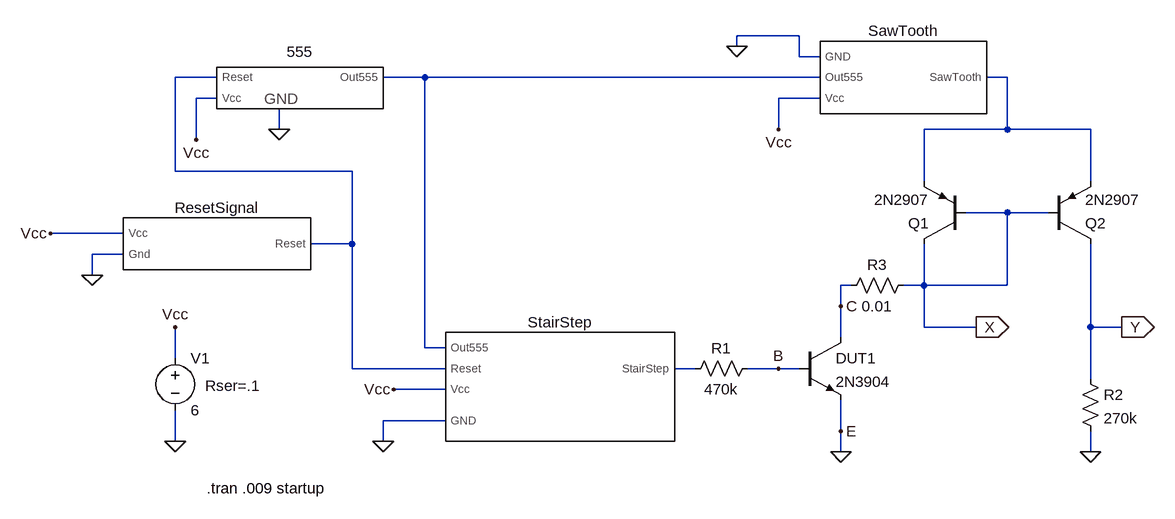
[diagram p0: schematic Mod5_DUT.asc]
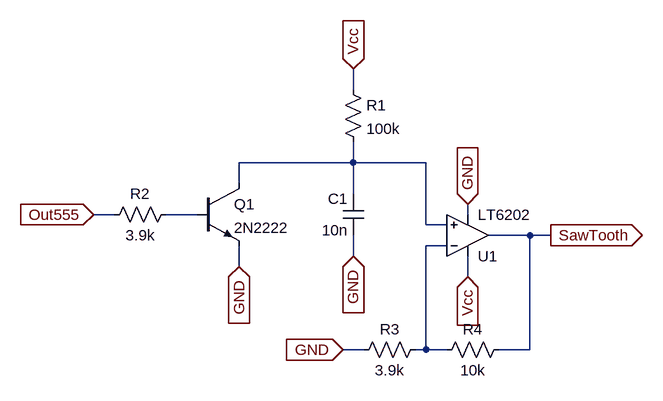
[diagram p1: sub-circuit mod4_sawtooth.asc]
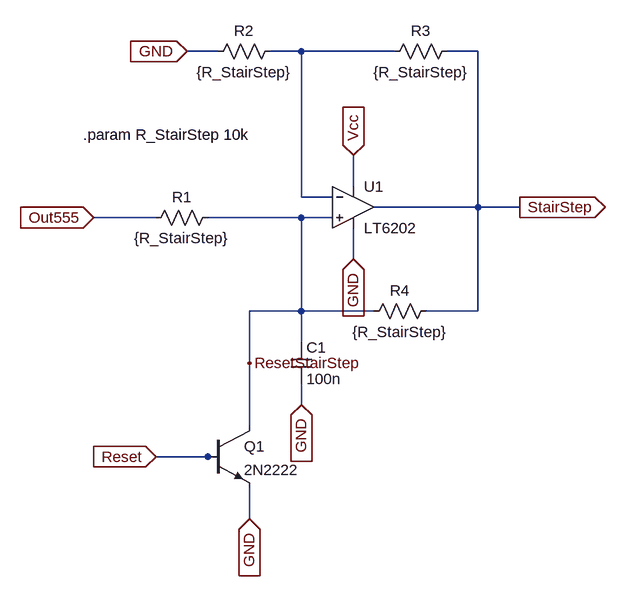
[diagram p2: sub-circuit mod3_stairstep.asc]
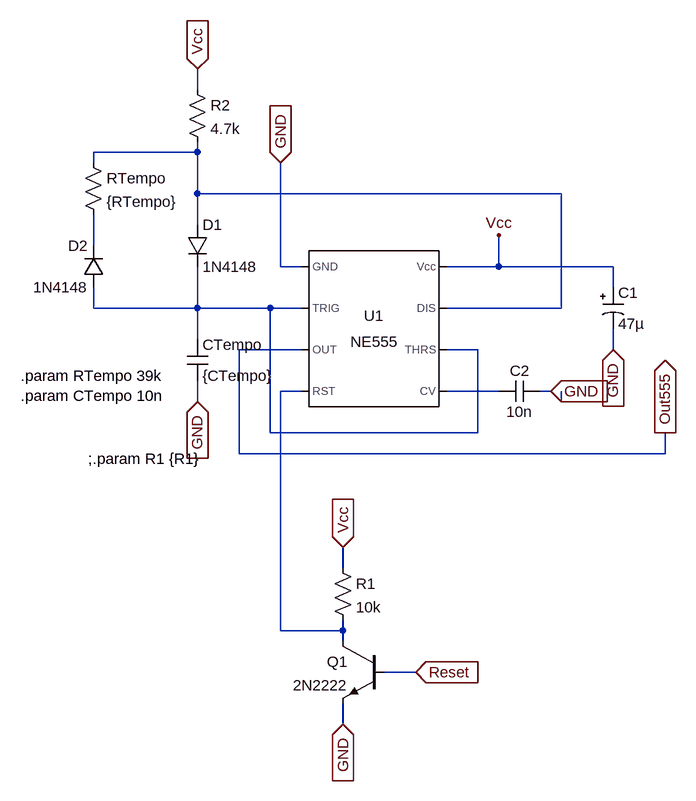
[diagram p3: sub-circuit mod1_555.asc]
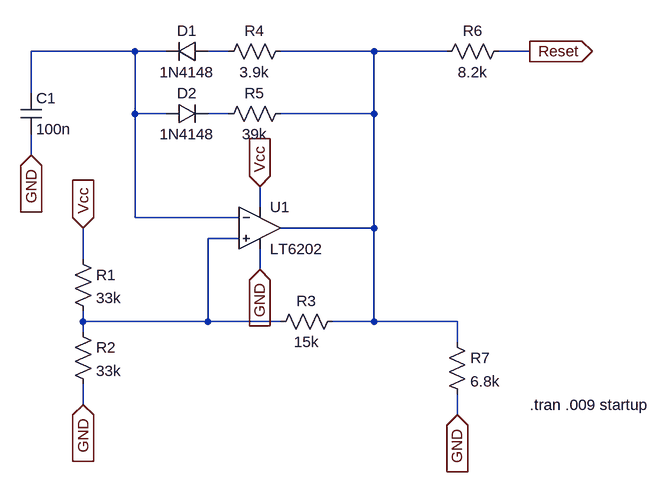
[diagram p4: sub-circuit mod2_resetsignal.asc]
Mod5_DUT.asc, the LTspice schematic file:
Version 4.1
SHEET 1 880 680
WIRE -240 -368 -336 -368
WIRE -336 -352 -336 -368
WIRE -240 -336 -240 -368
WIRE -208 -336 -240 -336
WIRE -1136 -304 -1200 -304
WIRE -816 -304 -880 -304
WIRE -208 -304 -816 -304
WIRE 80 -304 48 -304
WIRE -1136 -272 -1168 -272
WIRE -208 -272 -272 -272
WIRE -1040 -224 -1040 -256
WIRE -272 -224 -272 -272
WIRE 80 -224 80 -304
WIRE 80 -224 -48 -224
WIRE 208 -224 80 -224
WIRE -1168 -208 -1168 -272
WIRE -1200 -160 -1200 -304
WIRE -928 -160 -1200 -160
WIRE -48 -144 -48 -224
WIRE 208 -144 208 -224
WIRE 80 -96 16 -96
WIRE 144 -96 80 -96
WIRE -1280 -64 -1392 -64
WIRE -928 -48 -928 -160
WIRE -928 -48 -992 -48
WIRE -1280 -32 -1328 -32
WIRE -1328 0 -1328 -32
WIRE -160 16 -176 16
WIRE -48 16 -48 -48
WIRE -48 16 -80 16
WIRE 80 16 80 -96
WIRE 80 16 -48 16
WIRE -176 48 -176 16
WIRE -48 80 -48 16
WIRE 32 80 -48 80
WIRE 208 80 208 -48
WIRE 256 80 208 80
WIRE -176 96 -176 48
WIRE -816 112 -816 -304
WIRE -784 112 -816 112
WIRE -1200 128 -1200 80
WIRE -928 144 -928 -48
WIRE -784 144 -928 144
WIRE -400 144 -432 144
WIRE -272 144 -320 144
WIRE -240 144 -272 144
WIRE 208 160 208 80
WIRE -784 176 -864 176
WIRE -784 224 -880 224
WIRE -176 240 -176 192
WIRE -1200 256 -1200 208
WIRE -880 256 -880 224
WIRE -176 272 -176 240
WIRE 208 272 208 240
FLAG -176 48 C
FLAG -272 144 B
FLAG -176 240 E
FLAG 32 80 X
IOPIN 32 80 Out
FLAG 256 80 Y
IOPIN 256 80 Out
FLAG -176 272 0
FLAG 208 272 0
FLAG -336 -352 0
FLAG -880 256 0
FLAG -1328 0 0
FLAG -1040 -224 0
FLAG -1200 256 0
FLAG -1200 80 Vcc
FLAG -272 -224 Vcc
FLAG -1168 -208 Vcc
FLAG -1392 -64 Vcc
FLAG -864 176 Vcc
SYMBOL res -304 128 R90
WINDOW 0 0 56 VBottom 2
WINDOW 3 32 56 VTop 2
SYMATTR InstName R1
SYMATTR Value 470k
SYMBOL pnp 16 -48 R180
SYMATTR InstName Q1
SYMATTR Value 2N2907
SYMBOL pnp 144 -48 M180
SYMATTR InstName Q2
SYMATTR Value 2N2907
SYMBOL npn -240 96 R0
SYMATTR InstName DUT1
SYMATTR Value 2N3904
SYMBOL res 192 144 R0
SYMATTR InstName R2
SYMATTR Value 270k
SYMBOL res -64 0 R90
WINDOW 0 0 56 VBottom 2
WINDOW 3 32 56 VTop 2
SYMATTR InstName R3
SYMATTR Value 0.01
SYMBOL Mod4_SawTooth -80 -304 R0
SYMATTR InstName SawTooth
SYMBOL Mod3_StairStep -608 144 R0
SYMATTR InstName StairStep
SYMBOL Mod1_555 -1008 -288 R0
SYMATTR InstName 555
SYMBOL Mod2_ResetSignal -1136 -48 R0
SYMATTR InstName ResetSignal
SYMBOL voltage -1200 112 R0
WINDOW 123 0 0 Left 0
WINDOW 39 46 58 Left 2
SYMATTR SpiceLine Rser=.1
SYMATTR InstName V1
SYMATTR Value 6
TEXT -1152 328 Left 2 !.tran .009 startup

mod4_sawtooth.asc, the sub-circuit schematic file:
Version 4.1
SHEET 1 880 680
WIRE 256 16 256 -16
WIRE 256 128 256 96
WIRE 256 128 80 128
WIRE 368 128 256 128
WIRE 80 160 80 128
WIRE 256 176 256 128
WIRE -112 208 -144 208
WIRE 16 208 -32 208
WIRE 432 208 432 192
WIRE 368 224 368 128
WIRE 400 224 368 224
WIRE 528 240 464 240
WIRE 560 240 528 240
WIRE 400 256 368 256
WIRE 256 272 256 240
WIRE 80 288 80 256
WIRE 432 304 432 272
WIRE 272 416 240 416
WIRE 368 416 368 256
WIRE 368 416 352 416
WIRE 400 416 368 416
WIRE 528 416 528 240
WIRE 528 416 480 416
FLAG 256 -16 Vcc
IOPIN 256 -16 In
FLAG -144 208 Out555
IOPIN -144 208 In
FLAG 432 304 Vcc
IOPIN 432 304 In
FLAG 560 240 SawTooth
IOPIN 560 240 Out
FLAG 80 288 GND
IOPIN 80 288 In
FLAG 256 272 GND
IOPIN 256 272 In
FLAG 240 416 GND
IOPIN 240 416 In
FLAG 432 192 GND
IOPIN 432 192 In
SYMBOL npn 16 160 R0
SYMATTR InstName Q1
SYMATTR Value 2N2222
SYMBOL OpAmps\\LT6202 432 240 M180
SYMATTR InstName U1
SYMBOL cap 272 240 R180
WINDOW 0 24 56 Left 2
WINDOW 3 24 8 Left 2
SYMATTR InstName C1
SYMATTR Value 10n
SYMBOL res 240 0 R0
SYMATTR InstName R1
SYMATTR Value 100k
SYMBOL res -16 192 R90
WINDOW 0 0 56 VBottom 2
WINDOW 3 32 56 VTop 2
SYMATTR InstName R2
SYMATTR Value 3.9k
SYMBOL res 368 400 R90
WINDOW 0 0 56 VBottom 2
WINDOW 3 32 56 VTop 2
SYMATTR InstName R3
SYMATTR Value 3.9k
SYMBOL res 496 400 R90
WINDOW 0 0 56 VBottom 2
WINDOW 3 32 56 VTop 2
SYMATTR InstName R4
SYMATTR Value 10k

mod3_stairstep.asc, the sub-circuit schematic file:
Version 4.1
SHEET 1 880 704
WIRE 16 -128 -32 -128
WIRE 144 -128 96 -128
WIRE 288 -128 144 -128
WIRE 416 -128 368 -128
WIRE 224 80 224 32
WIRE 144 96 144 -128
WIRE 192 96 144 96
WIRE 416 112 416 -128
WIRE 416 112 256 112
WIRE 480 112 416 112
WIRE -80 128 -176 128
WIRE 144 128 0 128
WIRE 192 128 144 128
WIRE 224 192 224 144
WIRE 144 272 144 128
WIRE 144 272 64 272
WIRE 256 272 144 272
WIRE 416 272 416 112
WIRE 416 272 336 272
WIRE 144 320 144 272
WIRE 64 352 64 272
WIRE 144 416 144 384
WIRE 64 448 64 352
WIRE 0 496 -80 496
WIRE 16 496 0 496
WIRE 64 592 64 544
FLAG 224 32 Vcc
IOPIN 224 32 In
FLAG 480 112 StairStep
IOPIN 480 112 Out
FLAG 64 352 ResetStairStep
FLAG -176 128 Out555
IOPIN -176 128 In
FLAG -80 496 Reset
IOPIN -80 496 In
FLAG -32 -128 GND
IOPIN -32 -128 In
FLAG 224 192 GND
IOPIN 224 192 In
FLAG 144 416 GND
IOPIN 144 416 In
FLAG 64 592 GND
IOPIN 64 592 In
SYMBOL npn 0 448 R0
SYMATTR InstName Q1
SYMATTR Value 2N2222
SYMBOL res 16 112 R90
WINDOW 0 0 56 VBottom 2
WINDOW 3 32 56 VTop 2
SYMATTR InstName R1
SYMATTR Value {R_StairStep}
SYMBOL res 112 -144 R90
WINDOW 0 0 56 VBottom 2
WINDOW 3 32 56 VTop 2
SYMATTR InstName R2
SYMATTR Value {R_StairStep}
SYMBOL res 384 -144 R90
WINDOW 0 0 56 VBottom 2
WINDOW 3 32 56 VTop 2
SYMATTR InstName R3
SYMATTR Value {R_StairStep}
SYMBOL res 352 256 R90
WINDOW 0 0 56 VBottom 2
WINDOW 3 32 56 VTop 2
SYMATTR InstName R4
SYMATTR Value {R_StairStep}
SYMBOL cap 128 320 R0
SYMATTR InstName C1
SYMATTR Value 100n
SYMBOL OpAmps\\LT6202 224 112 R0
SYMATTR InstName U1
TEXT -192 0 Left 2 !.param R_StairStep 10k

mod1_555.asc, the sub-circuit schematic file:
Version 4.1
SHEET 1 1100 928
WIRE -160 -160 -160 -192
WIRE -160 -64 -160 -80
WIRE -160 -64 -320 -64
WIRE -320 -48 -320 -64
WIRE -160 0 -160 -64
WIRE 400 0 -160 0
WIRE -160 48 -160 0
WIRE -320 80 -320 32
WIRE -32 112 -32 -48
WIRE 0 112 -32 112
WIRE 304 112 304 64
WIRE 304 112 224 112
WIRE 480 112 304 112
WIRE 480 144 480 112
WIRE -320 176 -320 144
WIRE -160 176 -160 112
WIRE -160 176 -320 176
WIRE -48 176 -160 176
WIRE 0 176 -48 176
WIRE 400 176 400 0
WIRE 400 176 224 176
WIRE -160 224 -160 176
WIRE 0 240 -96 240
WIRE 272 240 224 240
WIRE 480 240 480 208
WIRE 0 304 -32 304
WIRE 304 304 224 304
WIRE 384 304 368 304
WIRE -160 320 -160 288
WIRE 400 320 400 304
WIRE -48 368 -48 176
WIRE 272 368 272 240
WIRE 272 368 -48 368
WIRE -96 400 -96 240
WIRE 560 400 560 368
WIRE 560 400 -96 400
WIRE 64 576 64 544
WIRE -32 672 -32 304
WIRE 64 672 64 656
WIRE 64 672 -32 672
WIRE 64 688 64 672
WIRE 176 736 128 736
WIRE 64 816 64 784
FLAG 304 64 Vcc
FLAG 560 368 Out555
IOPIN 560 368 Out
FLAG -160 -192 Vcc
IOPIN -160 -192 In
FLAG 480 240 GND
IOPIN 480 240 In
FLAG 384 304 GND
IOPIN 384 304 In
FLAG -32 -48 GND
IOPIN -32 -48 In
FLAG -160 320 GND
IOPIN -160 320 In
FLAG 64 544 Vcc
IOPIN 64 544 In
FLAG 64 816 GND
IOPIN 64 816 In
FLAG 176 736 Reset
IOPIN 176 736 In
SYMBOL Misc\\NE555 112 208 R0
SYMATTR InstName U1
SYMBOL polcap 464 144 R0
SYMATTR InstName C1
SYMATTR Value 47µ
SYMBOL cap 368 288 R90
WINDOW 0 0 32 VBottom 2
WINDOW 3 32 32 VTop 2
SYMATTR InstName C2
SYMATTR Value 10n
SYMBOL diode -176 48 R0
SYMATTR InstName D1
SYMATTR Value 1N4148
SYMBOL diode -304 144 R180
WINDOW 0 24 64 Left 2
WINDOW 3 24 0 Left 2
SYMATTR InstName D2
SYMATTR Value 1N4148
SYMBOL res -336 -64 R0
SYMATTR InstName RTempo
SYMATTR Value {RTempo}
SYMBOL res -176 -176 R0
SYMATTR InstName R2
SYMATTR Value 4.7k
SYMBOL cap -176 224 R0
SYMATTR InstName CTempo
SYMATTR Value {CTempo}
SYMBOL npn 128 688 M0
SYMATTR InstName Q1
SYMATTR Value 2N2222
SYMBOL res 48 560 R0
SYMATTR InstName R1
SYMATTR Value 10k
TEXT -328 408 Left 2 !;.param R1 {R1}
TEXT -432 280 Left 2 !.param RTempo 39k\n.param CTempo 10n

mod2_resetsignal.asc, the sub-circuit schematic file:
Version 4.1
SHEET 1 880 784
WIRE -272 112 -432 112
WIRE -224 112 -272 112
WIRE -128 112 -160 112
WIRE 96 112 -48 112
WIRE 208 112 96 112
WIRE 336 112 288 112
WIRE -432 176 -432 112
WIRE -272 208 -272 112
WIRE -224 208 -272 208
WIRE -128 208 -160 208
WIRE 96 208 96 112
WIRE 96 208 -48 208
WIRE -432 272 -432 240
WIRE -80 352 -80 320
WIRE -272 368 -272 208
WIRE -112 368 -272 368
WIRE 96 384 96 208
WIRE 96 384 -48 384
WIRE -112 400 -160 400
WIRE -352 432 -352 384
WIRE -80 448 -80 416
WIRE -352 528 -352 512
WIRE -160 528 -160 400
WIRE -160 528 -352 528
WIRE -48 528 -160 528
WIRE 96 528 96 384
WIRE 96 528 32 528
WIRE 224 528 96 528
WIRE -352 544 -352 528
WIRE 224 560 224 528
WIRE -352 656 -352 624
WIRE 224 672 224 640
FLAG -80 320 Vcc
IOPIN -80 320 In
FLAG -352 384 Vcc
IOPIN -352 384 In
FLAG 224 672 GND
IOPIN 224 672 In
FLAG -352 656 GND
IOPIN -352 656 In
FLAG -80 448 GND
IOPIN -80 448 In
FLAG -432 272 GND
IOPIN -432 272 In
FLAG 336 112 Reset
IOPIN 336 112 Out
SYMBOL res -368 416 R0
SYMATTR InstName R1
SYMATTR Value 33k
SYMBOL res -368 528 R0
SYMATTR InstName R2
SYMATTR Value 33k
SYMBOL res 48 512 R90
WINDOW 0 0 56 VBottom 2
WINDOW 3 32 56 VTop 2
SYMATTR InstName R3
SYMATTR Value 15k
SYMBOL res -32 96 R90
WINDOW 0 0 56 VBottom 2
WINDOW 3 32 56 VTop 2
SYMATTR InstName R4
SYMATTR Value 3.9k
SYMBOL res -32 192 R90
WINDOW 0 0 56 VBottom 2
WINDOW 3 32 56 VTop 2
SYMATTR InstName R5
SYMATTR Value 39k
SYMBOL res 304 96 R90
WINDOW 0 0 56 VBottom 2
WINDOW 3 32 56 VTop 2
SYMATTR InstName R6
SYMATTR Value 8.2k
SYMBOL cap -448 176 R0
SYMATTR InstName C1
SYMATTR Value 100n
SYMBOL diode -160 96 R90
WINDOW 0 0 32 VBottom 2
WINDOW 3 32 32 VTop 2
SYMATTR InstName D1
SYMATTR Value 1N4148
SYMBOL diode -224 224 R270
WINDOW 0 32 32 VTop 2
WINDOW 3 0 32 VBottom 2
SYMATTR InstName D2
SYMATTR Value 1N4148
SYMBOL res 208 544 R0
SYMATTR InstName R7
SYMATTR Value 6.8k
SYMBOL OpAmps\\LT6202 -80 384 R0
SYMATTR InstName U1
TEXT 336 656 Left 2 !.tran .009 startup

The netlist it stands for:
* Mod5_DUT.asc
R1 B N004 470k
Q1 X X N003 0 2N2907
Q2 Y X N003 0 2N2907
Q§DUT1 C B 0 0 2N3904
R2 Y 0 270k
R3 X C 0.01
X§SawTooth 0 N002 Vcc N003 mod4_sawtooth
X§StairStep N002 N001 Vcc N004 0 mod3_stairstep
X§555 0 Vcc N001 N002 mod1_555
X§ResetSignal Vcc 0 N001 mod2_resetsignal
V1 Vcc 0 6 Rser=.1

* block symbol definitions
.subckt mod4_sawtooth GND Out555 Vcc SawTooth
Q1 N001 N002 GND 0 2N2222
* U1: LT6202 (symbol OpAmps\LT6202 not available, pins judged from their places): In+=N001 In-=N003 V+=Vcc V-=GND OUT=SawTooth
C1 GND N001 10n
R1 Vcc N001 100k
R2 N002 Out555 3.9k
R3 N003 GND 3.9k
R4 SawTooth N003 10k
.ends mod4_sawtooth

.subckt mod3_stairstep Out555 Reset Vcc StairStep GND
Q1 ResetStairStep Reset GND 0 2N2222
R1 ResetStairStep Out555 {R_StairStep}
R2 N001 GND {R_StairStep}
R3 StairStep N001 {R_StairStep}
R4 StairStep ResetStairStep {R_StairStep}
C1 ResetStairStep GND 100n
* U1: LT6202 (symbol OpAmps\LT6202 not available, pins judged from their places): In+=ResetStairStep In-=N001 V+=Vcc V-=GND OUT=StairStep
.param R_StairStep 10k
.ends mod3_stairstep

.subckt mod1_555 GND Vcc Reset Out555
X§U1 GND N003 Out555 N004 N005 N003 N001 Vcc NE555  ; pins GND TRIG OUT RST CV THRS DIS Vcc
C1 Vcc GND 47µ
C2 GND N005 10n
D1 N001 N003 1N4148
D2 N003 N002 1N4148
RTempo N001 N002 {RTempo}
R2 Vcc N001 4.7k
CTempo N003 GND {CTempo}
Q1 N004 Reset GND 0 2N2222
R1 Vcc N004 10k
;.param R1 {R1}
.param RTempo 39k
.param CTempo 10n
.ends mod1_555

.subckt mod2_resetsignal Vcc Gnd Reset
R1 Vcc N005 33k
R2 N005 GND 33k
R3 N003 N005 15k
R4 N003 N002 3.9k
R5 N003 N004 39k
R6 Reset N003 8.2k
C1 N001 GND 100n
D1 N002 N001 1N4148
D2 N001 N004 1N4148
R7 N003 GND 6.8k
* U1: LT6202 (symbol OpAmps\LT6202 not available, pins judged from their places): In+=N005 In-=N001 V+=Vcc V-=GND OUT=N003
.tran .009 startup
.ends mod2_resetsignal

.model D D
.lib standard.dio
.model NPN NPN
.model PNP PNP
.lib standard.bjt
.tran .009 startup
.lib NE555.sub
.backanno
.end